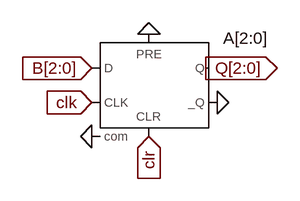
[diagram p0: schematic dbuf_3bit.asc]
dbuf_3bit.asc, the LTspice schematic file:
Version 4
SHEET 1 880 680
FLAG 96 208 0
FLAG 176 64 0
FLAG 176 208 clr
IOPIN 176 208 In
FLAG 96 160 clk
IOPIN 96 160 In
FLAG 96 112 B[2:0]
IOPIN 96 112 In
FLAG 272 160 0
FLAG 256 112 Q[2:0]
IOPIN 256 112 Out
SYMBOL Digital\\dflop 176 64 R0
SYMATTR InstName A[2:0]

The netlist it stands for:
* dbuf_3bit.asc
A[2:0] B[2:0] 0 clk 0 clr 0 Q[2:0] 0 DFLOP
.backanno
.end